# EAGLE design debug (EAGLE 5.09)
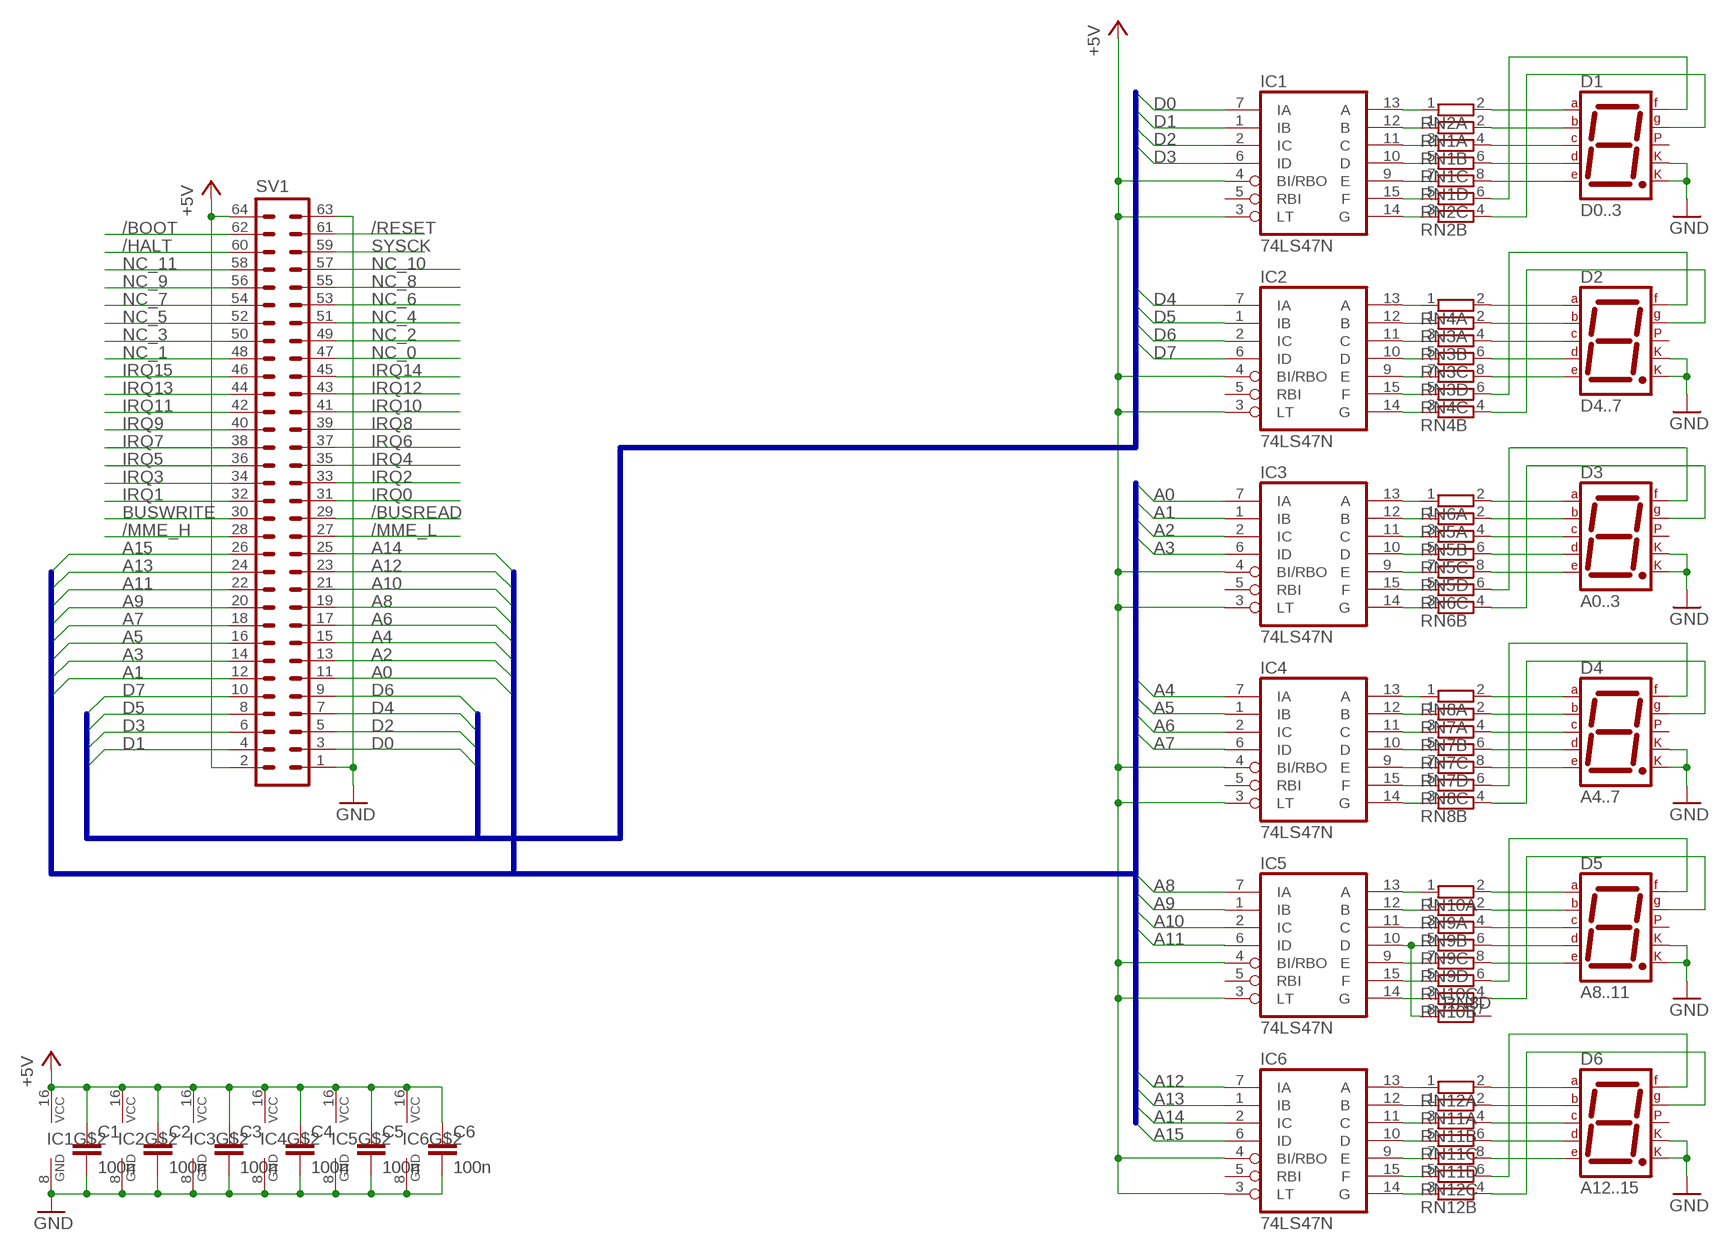
[diagram p0: schematic, sheet 1]

## Parts
C1  100n  C-EU025-024X044  [C025-024X044]
C2  100n  C-EU025-024X044  [C025-024X044]
C3  100n  C-EU025-024X044  [C025-024X044]
C4  100n  C-EU025-024X044  [C025-024X044]
C5  100n  C-EU025-024X044  [C025-024X044]
C6  100n  C-EU025-024X044  [C025-024X044]
D1  D0..3  7SEG-CK  [7SEG-13]
D2  D4..7  7SEG-CK  [7SEG-13]
D3  A0..3  7SEG-CK  [7SEG-13]
D4  A4..7  7SEG-CK  [7SEG-13]
D5  A8..11  7SEG-CK  [7SEG-13]
D6  A12..15  7SEG-CK  [7SEG-13]
IC1  74LS47N  [DIL16]
IC2  74LS47N  [DIL16]
IC3  74LS47N  [DIL16]
IC4  74LS47N  [DIL16]
IC5  74LS47N  [DIL16]
IC6  74LS47N  [DIL16]
RN1  E4R  [SIL8]
RN2  E4R  [SIL8]
RN3  E4R  [SIL8]
RN4  E4R  [SIL8]
RN5  E4R  [SIL8]
RN6  E4R  [SIL8]
RN7  E4R  [SIL8]
RN8  E4R  [SIL8]
RN9  E4R  [SIL8]
RN10  E4R  [SIL8]
RN11  E4R  [SIL8]
RN12  E4R  [SIL8]
SV1  ML64L  [ML64L]

## Nets
+5V: C1.1 C2.1 C3.1 C4.1 C5.1 C6.1 IC1.3(LT) IC1.4(BI/RBO) IC1.16(VCC) IC2.3(LT) IC2.4(BI/RBO) IC2.16(VCC) IC3.3(LT) IC3.4(BI/RBO) IC3.16(VCC) IC4.3(LT) IC4.4(BI/RBO) IC4.16(VCC) IC5.3(LT) IC5.4(BI/RBO) IC5.16(VCC) IC6.3(LT) IC6.4(BI/RBO) IC6.16(VCC) SV1.2 SV1.64
/BOOT: SV1.62
/BUSREAD: SV1.29
/HALT: SV1.60
/MME_H: SV1.28
/MME_L: SV1.27
/RESET: SV1.61
A0: IC3.7(IA) SV1.11
A1: IC3.1(IB) SV1.12
A2: IC3.2(IC) SV1.13
A3: IC3.6(ID) SV1.14
A4: IC4.7(IA) SV1.15
A5: IC4.1(IB) SV1.16
A6: IC4.2(IC) SV1.17
A7: IC4.6(ID) SV1.18
A8: IC5.7(IA) SV1.19
A9: IC5.1(IB) SV1.20
A10: IC5.2(IC) SV1.21
A11: IC5.6(ID) SV1.22
A12: IC6.7(IA) SV1.23
A13: IC6.1(IB) SV1.24
A14: IC6.2(IC) SV1.25
A15: IC6.6(ID) SV1.26
BUSWRITE: SV1.30
D0: IC1.7(IA) SV1.3
D1: IC1.1(IB) SV1.4
D2: IC1.2(IC) SV1.5
D3: IC1.6(ID) SV1.6
D4: IC2.7(IA) SV1.7
D5: IC2.1(IB) SV1.8
D6: IC2.2(IC) SV1.9
D7: IC2.6(ID) SV1.10
GND: C1.2 C2.2 C3.2 C4.2 C5.2 C6.2 D1.3(CK1) D1.8(CK2) D2.3(CK1) D2.8(CK2) D3.3(CK1) D3.8(CK2) D4.3(CK1) D4.8(CK2) D5.3(CK1) D5.8(CK2) D6.3(CK1) D6.8(CK2) IC1.8(GND) IC2.8(GND) IC3.8(GND) IC4.8(GND) IC5.8(GND) IC6.8(GND) SV1.1 SV1.63
IRQ0: SV1.31
IRQ1: SV1.32
IRQ2: SV1.33
IRQ3: SV1.34
IRQ4: SV1.35
IRQ5: SV1.36
IRQ6: SV1.37
IRQ7: SV1.38
IRQ8: SV1.39
IRQ9: SV1.40
IRQ10: SV1.41
IRQ11: SV1.42
IRQ12: SV1.43
IRQ13: SV1.44
IRQ14: SV1.45
IRQ15: SV1.46
N$1: IC1.13(A) RN2.1
N$2: IC1.12(B) RN1.1
N$3: IC1.11(C) RN1.3
N$4: IC1.10(D) RN1.5
N$5: IC1.9(E) RN1.7
N$6: IC1.15(F) RN2.5
N$7: IC1.14(G) RN2.3
N$8: D1.7(A) RN2.2
N$9: D1.6(B) RN1.2
N$10: D1.4(C) RN1.4
N$11: D1.2(D) RN1.6
N$12: D1.1(E) RN1.8
N$13: D1.9(F) RN2.6
N$14: D1.10(G) RN2.4
N$15: IC2.13(A) RN4.1
N$16: IC2.12(B) RN3.1
N$17: IC2.11(C) RN3.3
N$18: IC2.10(D) RN3.5
N$19: IC2.9(E) RN3.7
N$20: IC2.15(F) RN4.5
N$21: IC2.14(G) RN4.3
N$22: D2.7(A) RN4.2
N$23: D2.6(B) RN3.2
N$24: D2.4(C) RN3.4
N$25: D2.2(D) RN3.6
N$26: D2.1(E) RN3.8
N$27: D2.9(F) RN4.6
N$28: D2.10(G) RN4.4
N$29: IC3.13(A) RN6.1
N$30: IC3.12(B) RN5.1
N$31: IC3.11(C) RN5.3
N$32: IC3.10(D) RN5.5
N$33: IC3.9(E) RN5.7
N$34: IC3.15(F) RN6.5
N$35: IC3.14(G) RN6.3
N$36: D3.7(A) RN6.2
N$37: D3.6(B) RN5.2
N$38: D3.4(C) RN5.4
N$39: D3.2(D) RN5.6
N$40: D3.1(E) RN5.8
N$41: D3.9(F) RN6.6
N$42: D3.10(G) RN6.4
N$43: IC4.13(A) RN8.1
N$44: IC4.12(B) RN7.1
N$45: IC4.11(C) RN7.3
N$46: IC4.10(D) RN7.5
N$47: IC4.9(E) RN7.7
N$48: IC4.15(F) RN8.5
N$49: IC4.14(G) RN8.3
N$50: D4.7(A) RN8.2
N$51: D4.6(B) RN7.2
N$52: D4.4(C) RN7.4
N$53: D4.2(D) RN7.6
N$54: D4.1(E) RN7.8
N$55: D4.9(F) RN8.6
N$56: D4.10(G) RN8.4
N$57: IC5.13(A) RN10.1
N$58: IC5.12(B) RN9.1
N$59: IC5.11(C) RN9.3
N$60: IC5.10(D) RN8.8 RN9.5
N$61: IC5.9(E) RN9.7
N$62: IC5.15(F) RN10.5
N$63: IC5.14(G) RN10.3
N$64: D5.7(A) RN10.2
N$65: D5.6(B) RN9.2
N$66: D5.4(C) RN9.4
N$67: D5.2(D) RN9.6
N$68: D5.1(E) RN9.8
N$69: D5.9(F) RN10.6
N$70: D5.10(G) RN10.4
N$71: IC6.13(A) RN12.1
N$72: IC6.12(B) RN11.1
N$73: IC6.11(C) RN11.3
N$74: IC6.10(D) RN11.5
N$75: IC6.9(E) RN11.7
N$76: IC6.15(F) RN12.5
N$77: IC6.14(G) RN12.3
N$78: D6.7(A) RN12.2
N$79: D6.6(B) RN11.2
N$80: D6.4(C) RN11.4
N$81: D6.2(D) RN11.6
N$82: D6.1(E) RN11.8
N$83: D6.9(F) RN12.6
N$84: D6.10(G) RN12.4
NC_0: SV1.47
NC_1: SV1.48
NC_2: SV1.49
NC_3: SV1.50
NC_4: SV1.51
NC_5: SV1.52
NC_6: SV1.53
NC_7: SV1.54
NC_8: SV1.55
NC_9: SV1.56
NC_10: SV1.57
NC_11: SV1.58
SYSCK: SV1.59
Unconnected: D1.5(DP) D2.5(DP) D3.5(DP) D4.5(DP) D5.5(DP) D6.5(DP) IC1.5(RBI) IC2.5(RBI) IC3.5(RBI) IC4.5(RBI) IC5.5(RBI) IC6.5(RBI) RN2.7 RN2.8 RN4.7 RN4.8 RN6.7 RN6.8 RN8.7 RN10.7 RN10.8 RN12.7 RN12.8

## Buses
D[0..7]
A[0..15]

## Library data of the parts
C1-C6 = rcl:C-EU: CAPACITOR, European symbol
D1-D6 = special:7SEG-CK: 7-segment DISPLAY single cathode, 13 mm
IC1-IC6 = 74xx-eu:74*47: BCD to seven segment DECODER/DRIVER Source: http://www.ee.washington.edu/stores/DataSheets/74ls/74ls47.pdf
RN1-RN12 = resistor-sil:E4R: SIL RESISTOR
SV1 = mcpu:ML64L: HARTING

## Net classes
0 Signal: width 0.254 mm, drill 0.508 mm, clearance 0.203 mm
1 LoVolt42: width 0.61 mm, drill 0.508 mm, clearance 0.813 mm to class 0, clearance 0.305 mm
2 MedVolt100: width 0.61 mm, drill 0.508 mm, clearance 1.626 mm to class 0, clearance 1.626 mm to class 1, clearance 0.813 mm
3 LineVolt350: width 0.813 mm, drill 0.508 mm, clearance 12.7 mm to class 0, clearance 12.7 mm to class 1, clearance 12.7 mm to class 2, clearance 2.54 mm

## Board
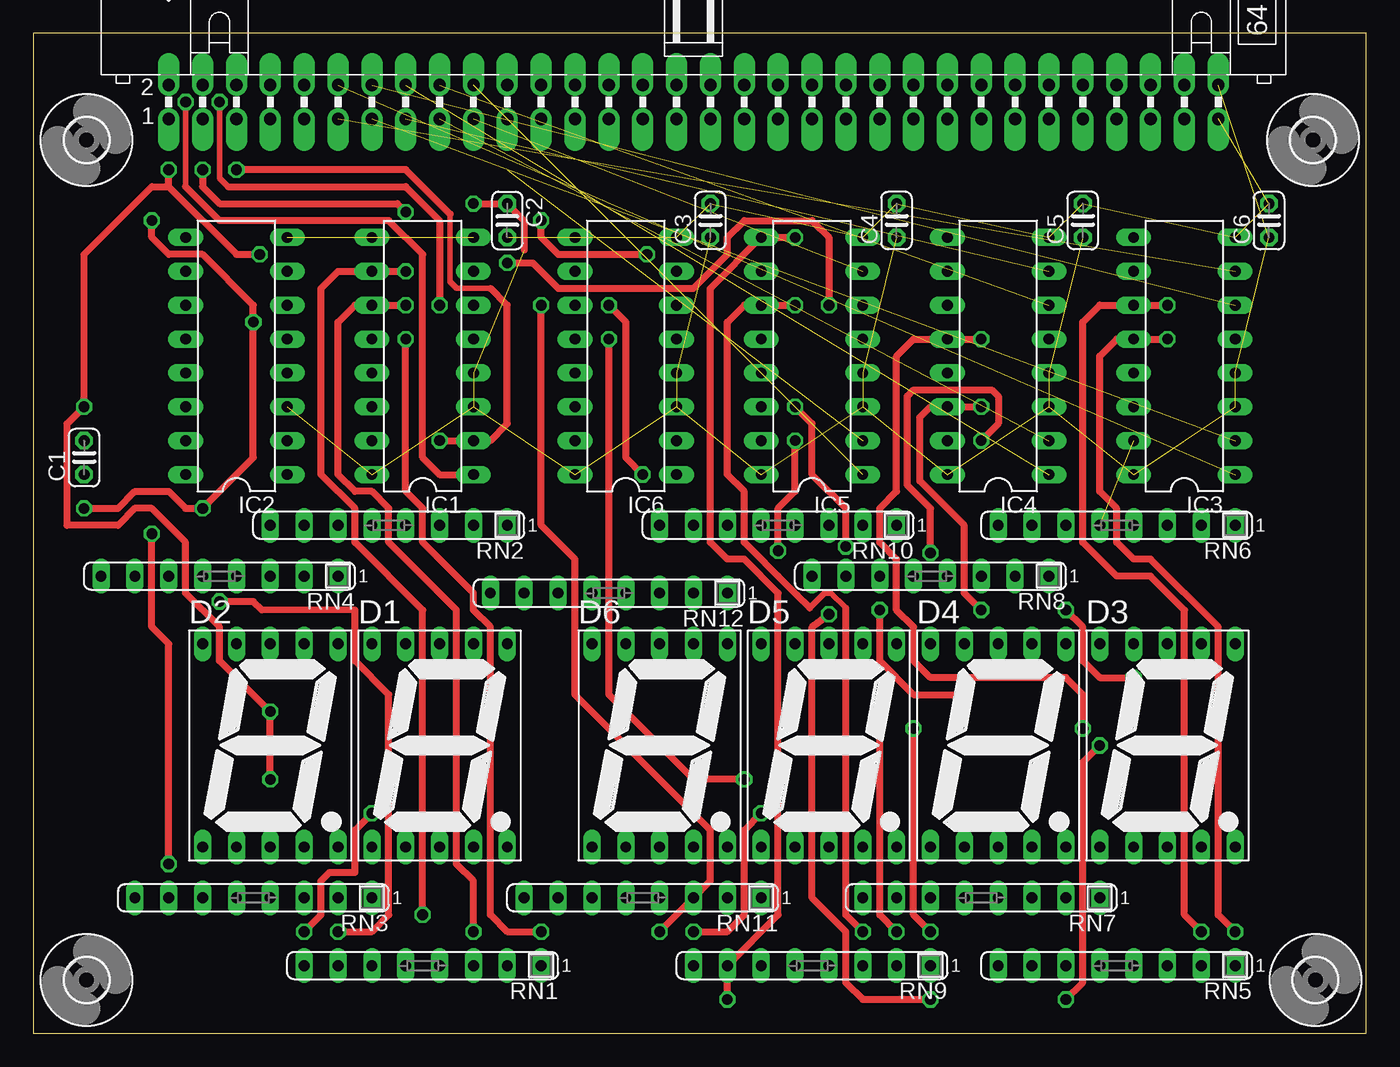
[diagram p1: board, top side]
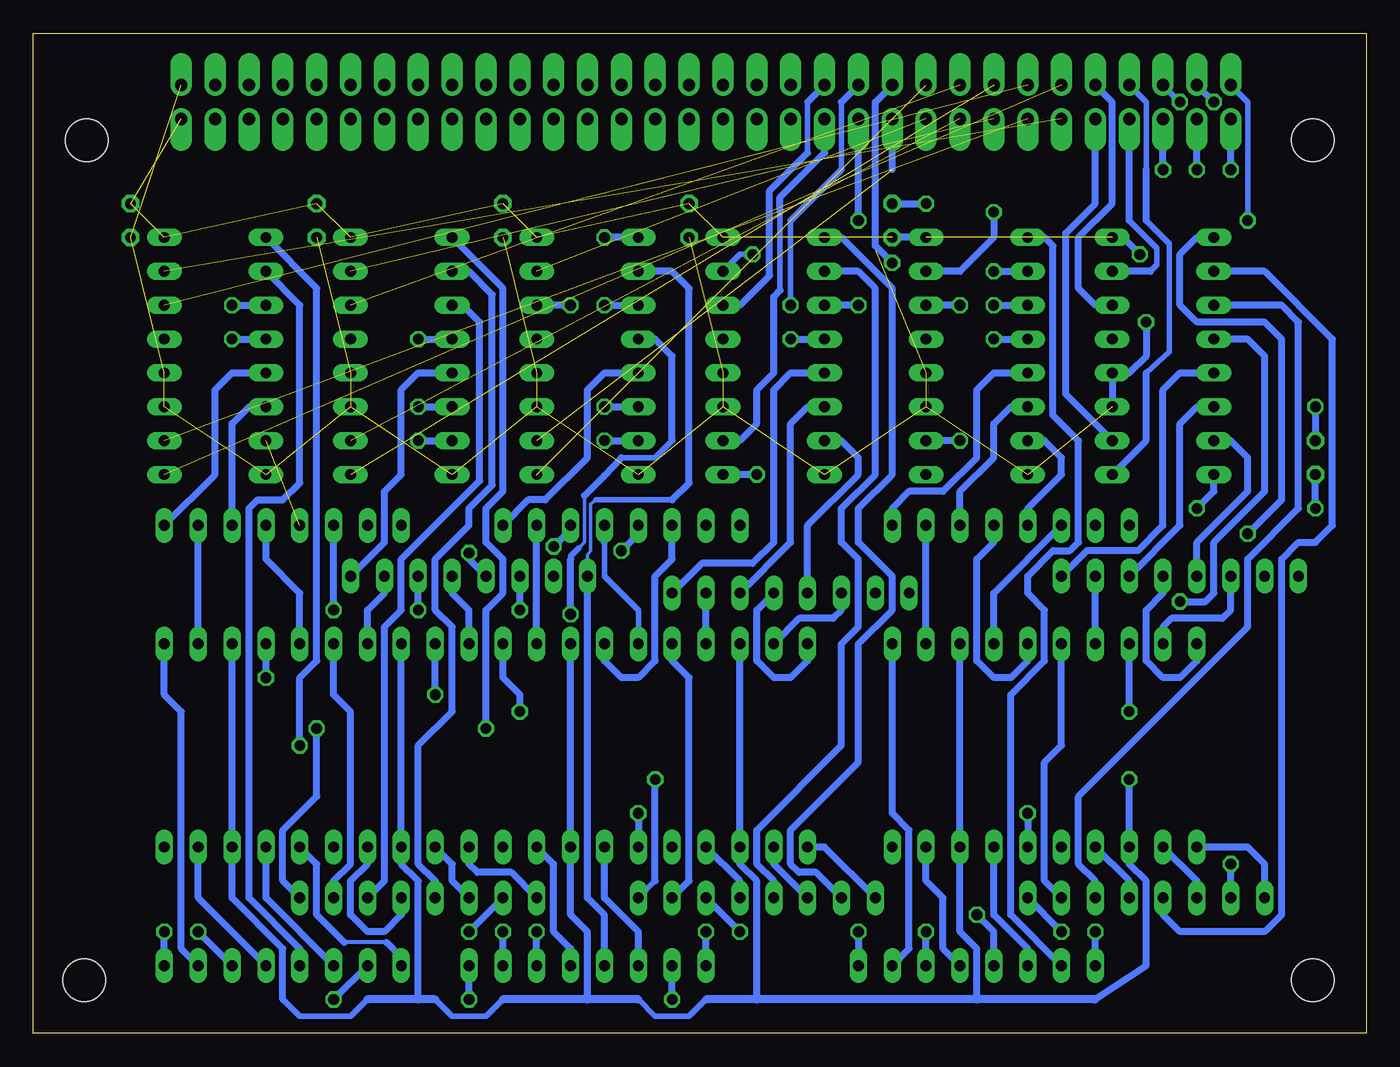
[diagram p2: board, bottom side, seen from below]

Size 100 x 75 mm. Coordinates in mm from the lower left corner, seen from the top.
Outline: 0,0 100,0 100,75 0,75 0,0
Copper layers (1*16): Top 0.035mm / dielectric 1.5mm / Bottom 0.035mm
Design rules "designrules": minimum track width 10mil, minimum drill 24mil, track to track 8mil, track to pad 8mil, pad to pad 8mil, via to via 8mil, smd to smd 8mil, copper to edge 40mil, drill to drill 8mil, minimum pad ring 10mil, minimum via ring 8mil, stop-mask expansion 4mil, vias tented up to drill 0mil, thermal gap 10mil

### Footprints (pad centres in the part's own frame; a part is rotated, then mirrored left to right if it is on the bottom)
C025-024X044 = drill 0.813 octagon: 1 -1.27,0; 2 1.27,0
7SEG-13 = drill 0.813 long: 1 -5.08,-7.62; 2 -2.54,-7.62; 3 0,-7.62; 4 2.54,-7.62; 5 5.08,-7.62; 6 5.08,7.62; 7 2.54,7.62; 8 0,7.62; 9 -2.54,7.62; 10 -5.08,7.62
DIL16 = drill 0.813 long: 1 -8.89,-3.81; 2 -6.35,-3.81; 3 -3.81,-3.81; 4 -1.27,-3.81; 5 1.27,-3.81; 6 3.81,-3.81; 7 6.35,-3.81; 8 8.89,-3.81; 9 8.89,3.81; 10 6.35,3.81; 11 3.81,3.81; 12 1.27,3.81; 13 -1.27,3.81; 14 -3.81,3.81; 15 -6.35,3.81; 16 -8.89,3.81
SIL8 = drill 0.813 long: 1 -8.89,0; 2 -6.35,0; 3 -3.81,0; 4 -1.27,0; 5 1.27,0; 6 3.81,0; 7 6.35,0; 8 8.89,0
ML64L = drill 0.914 pad 1.6 offset: 1 -39.37,-1.27; 2 -39.37,1.27; 3 -36.83,-1.27; 4 -36.83,1.27; 5 -34.29,-1.27; 6 -34.29,1.27; 7 -31.75,-1.27; 8 -31.75,1.27; 9 -29.21,-1.27; 10 -29.21,1.27; 11 -26.67,-1.27; 12 -26.67,1.27; 13 -24.13,-1.27; 14 -24.13,1.27; 15 -21.59,-1.27; 16 -21.59,1.27; 17 -19.05,-1.27; 18 -19.05,1.27; 19 -16.51,-1.27; 20 -16.51,1.27; 21 -13.97,-1.27; 22 -13.97,1.27; 23 -11.43,-1.27; 24 -11.43,1.27; 25 -8.89,-1.27; 26 -8.89,1.27; 27 -6.35,-1.27; 28 -6.35,1.27; 29 -3.81,-1.27; 30 -3.81,1.27; 31 -1.27,-1.27; 32 -1.27,1.27; 33 1.27,-1.27; 34 1.27,1.27; 35 3.81,-1.27; 36 3.81,1.27; 37 6.35,-1.27; 38 6.35,1.27; 39 8.89,-1.27; 40 8.89,1.27; 41 11.43,-1.27; 42 11.43,1.27; 43 13.97,-1.27; 44 13.97,1.27; 45 16.51,-1.27; 46 16.51,1.27; 47 19.05,-1.27; 48 19.05,1.27; 49 21.59,-1.27; 50 21.59,1.27; 51 24.13,-1.27; 52 24.13,1.27; 53 26.67,-1.27; 54 26.67,1.27; 55 29.21,-1.27; 56 29.21,1.27; 57 31.75,-1.27; 58 31.75,1.27; 59 34.29,-1.27; 60 34.29,1.27; 61 36.83,-1.27; 62 36.83,1.27; 63 39.37,-1.27; 64 39.37,1.27
3,2 = hole 3.2: 0,0

### Placement (x,y rotation side)
C1  3.81,43.18 90 top
C2  35.56,60.96 270 top
C3  50.8,60.96 90 top
C4  64.77,60.96 90 top
C5  78.74,60.96 90 top
C6  92.71,60.96 90 top
D1  30.48,21.59 0 top
D2  17.78,21.59 0 top
D3  85.09,21.59 0 top
D4  72.39,21.59 0 top
D5  59.69,21.59 0 top
D6  46.99,21.59 0 top
IC1  29.21,50.8 90 top
IC2  15.24,50.8 90 top
IC3  86.36,50.8 90 top
IC4  72.39,50.8 90 top
IC5  58.42,50.8 90 top
IC6  44.45,50.8 90 top
RN1  29.21,5.08 180 top
RN2  26.67,38.1 180 top
RN3  16.51,10.16 180 top
RN4  13.97,34.29 180 top
RN5  81.28,5.08 180 top
RN6  81.28,38.1 180 top
RN7  71.12,10.16 180 top
RN8  67.31,34.29 180 top
RN9  58.42,5.08 180 top
RN10  55.88,38.1 180 top
RN11  45.72,10.16 180 top
RN12  43.18,33.02 180 top
SV1  49.53,69.85 0 top
U$1  [3,2]  4,4 0 top
U$2  [3,2]  4,67 0 top
U$3  [3,2]  96,67 0 top
U$4  [3,2]  96.19,4 0 top

### Tracks (layer width: path | path; a pad name or v marks a point on that pad's centre or on a via)
+5V  (via drill 0.8)  (21 unrouted)
  Top 0.508: v3.81,39.37 6.35,39.37 7.62,40.64 10.16,40.64 11.43,39.37 v12.7,39.37 16.51,43.18 v16.51,53.34 16.51,54.61 12.7,58.42 10.16,58.42 8.89,59.69 v8.89,60.96 | v33.02,62.23 C2.1 36.83,60.96 36.83,58.74
  Bottom 0.406: v8.89,60.96 8.89,69.85 SV1.2
  Bottom 0.508: IC2.16 11.43,40.64 v12.7,39.37 | v3.81,39.37 C1.1 | IC2.3 IC2.4 17.78,49.53 16.51,50.8 v16.51,53.34 | C2.1 v33.02,62.23
A0  (1 unrouted)
A1  (1 unrouted)
A2  (1 unrouted)
A3  (1 unrouted)
A4  (1 unrouted)
A5  (1 unrouted)
A6  (1 unrouted)
A7  (1 unrouted)
A8  (1 unrouted)
A9  (1 unrouted)
A10  (1 unrouted)
  Bottom 0.508: 35.56,64.77 SV1.21
A11  (via drill 0.8)
  Top 0.508: v35.56,57.78 37.47,57.78 39.37,55.88 49.53,55.88 52.07,58.42 52.07,59.69 53.34,60.96 58.42,60.96 59.69,59.69 v59.69,54.61
  Bottom 0.508: SV1.22 36.83,69.85 36.83,59.05 v35.56,57.78 | v59.69,54.61 IC5.6
A12  (via drill 0.8)
  Top 0.508: v38.1,60.96 38.1,59.69 39.37,58.42 v46.04,58.42
  Bottom 0.406: v46.04,58.42 46.99,58.42 IC6.7
  Bottom 0.508: v38.1,60.96 SV1.23
A13  (via drill 0.8)
  Top 0.508: v43.18,54.61 44.45,53.34 44.45,43.18 v45.72,41.91
  Bottom 0.406: 39.37,64.77 39.37,69.85 | v43.18,54.61 43.18,60.96
  Bottom 0.508: 39.37,69.85 SV1.24 | 43.18,60.96 39.37,64.77 | v45.72,41.91 IC6.1
A14
  Bottom 0.406: 43.97,55.72 43.97,61.75
  Bottom 0.508: SV1.25 40.64,66.04 43.97,62.71 43.97,61.75 | 43.97,55.72 44.45,55.24 44.45,49.53 45.72,48.26 45.72,45.72 46.99,44.45 IC6.2
A15
  Bottom 0.406: 41.91,66.04 41.91,69.85
  Bottom 0.508: 41.91,69.85 SV1.26 | 41.91,66.04 44.77,63.18 44.77,56.83 46.99,54.61 IC6.6
D0  (via drill 0.8)
  Top 0.508: v12.7,64.77 12.7,63.5 13.97,62.23 27.3,62.23 v27.94,61.59
  Bottom 0.508: v12.7,64.77 SV1.3 | v27.94,61.59 27.94,59.69 30.48,57.15 IC1.7
D1  (via drill 0.8)
  Top 0.406: 11.43,63.5 v11.43,69.85
  Top 0.508: 11.43,63.5 13.97,60.96 26.67,60.96 29.21,58.42 29.21,43.18 30.48,41.91 IC1.1
  Bottom 0.508: v11.43,69.85 SV1.4
D2  (via drill 0.8)
  Top 0.406: 31.27,61.44 31.27,56.36 31.75,55.88 34.29,55.88
  Top 0.508: v15.24,64.77 27.94,64.77 31.27,61.44 | 34.29,55.88 35.56,54.61 35.56,45.72 34.29,44.45 v30.48,44.45
  Bottom 0.508: v15.24,64.77 SV1.5 | v30.48,44.45 IC1.2
D3  (via drill 0.8)
  Top 0.406: v13.97,69.85 13.97,64.14 14.61,63.5
  Top 0.508: 14.61,63.5 27.94,63.5 30.48,60.96 v30.48,54.61
  Bottom 0.406: v13.97,69.85 SV1.6
  Bottom 0.508: v30.48,54.61 IC1.6
D4
  Bottom 0.406: 17.78,60.96 15.72,58.9 15.72,57.63 16.19,57.15
  Bottom 0.508: 17.78,60.96 SV1.7 | 16.19,57.15 IC2.7
D5
  Bottom 0.406: 16.51,64.77 16.51,69.85 SV1.8 | 16.51,60.96 14.76,59.21 14.76,51.12 16.51,49.53
  Bottom 0.508: IC2.1 16.51,44.45 16.51,49.53 | 16.51,60.96 16.51,64.77
D6
  Bottom 0.508: SV1.9 20.32,62.23 22.54,60.01 22.54,47.94 IC2.2
D7
  Bottom 0.508: SV1.10 19.05,69.85 19.05,62.23 21.59,59.69 21.59,55.88 20.32,54.61 IC2.6
GND  (via drill 0.8)  (10 unrouted)
  Top 0.508: v17.78,19.05 v17.78,24.13 13.97,27.94 13.97,30.48 11.43,33.02 11.43,36.83 8.89,39.37 7.62,39.37 6.35,38.1 2.54,38.1 2.54,45.72 v3.81,46.99 3.81,58.42 8.89,63.5 10.16,63.5 | v16.99,58.42 15.24,58.42 10.16,63.5 | 10.16,63.5 v10.16,64.77
  Bottom 0.406: 74.93,2.54 76.2,1.27 80.01,1.27 81.28,2.54 | 64.77,2.54 66.04,1.27 68.58,1.27 69.85,2.54 | 49.53,2.54 50.8,1.27 53.34,1.27 54.61,2.54
  Bottom 0.508: 20.32,2.54 16.51,5.08 16.51,11.43 17.78,12.7 D2.3 v17.78,19.05 | 29.21,2.54 29.21,6.35 30.48,7.62 D1.3 D1.8 | 45.72,2.54 45.72,11.43 46.99,12.7 D6.3 D6.8 | 58.42,2.54 58.42,7.62 59.69,8.89 D5.3 D5.8 | 71.12,2.54 71.12,11.43 72.39,12.7 D4.3 D4.8 | v17.78,24.13 D2.8 | D3.8 D3.3 85.09,10.16 81.28,6.35 81.28,2.54 | IC2.8 18.26,59.69 v16.99,58.42 | v10.16,64.77 SV1.1 | v3.81,46.99 C1.2 | IC1.8 C2.2
  Bottom 0.61: 74.93,2.54 71.12,2.54 69.85,2.54 | 64.77,2.54 58.42,2.54 54.61,2.54 | 49.53,2.54 45.72,2.54 29.21,2.54 20.32,2.54
N$1
  Bottom 0.508: RN2.1 35.56,39.37 34.29,40.64 31.75,40.64 29.21,43.18 29.21,48.26 27.94,49.53 IC1.13
N$2  (via drill 0.8)
  Top 0.508: v38.1,7.62 35.56,7.62 34.29,8.89 34.29,30.48 33.02,31.75 33.02,33.02 29.21,36.83 29.21,39.37 27.94,40.64 v27.94,52.07
  Bottom 0.508: v38.1,7.62 RN1.1 | v27.94,52.07 IC1.12
N$3  (via drill 0.8)
  Top 0.508: v33.02,7.62 33.02,11.43 31.75,12.7 31.75,31.75 26.67,36.83 26.67,39.37 25.4,40.64 24.13,40.64 22.86,41.91 22.86,53.34 24.13,54.61 v27.94,54.61
  Bottom 0.508: RN1.3 v33.02,7.62 | v27.94,54.61 IC1.11
N$4  (via drill 0.8)
  Top 0.508: v29.21,8.89 29.21,31.75 24.13,36.83 24.13,39.37 21.59,41.91 21.59,55.88 22.86,57.15 v27.94,57.15
  Bottom 0.508: RN1.5 27.94,7.62 v29.21,8.89 | v27.94,57.15 IC1.10
N$5
  Bottom 0.508: RN1.7 26.67,8.89 26.67,25.4 24.13,27.94 24.13,31.75 25.4,33.02 25.4,34.29 23.5,36.2 22.23,36.2 21.59,36.83 21.59,44.45 23.5,46.35 23.5,59.05 24.13,59.69 IC1.9
N$6
  Bottom 0.508: RN2.5 25.4,39.37 22.86,41.91 22.86,43.18 24.13,44.45 IC1.15
N$7
  Bottom 0.508: RN2.3 30.48,40.64 27.94,43.18 27.94,45.72 26.67,46.99 IC1.14
N$8
  Bottom 0.508: D1.7 RN2.2
N$9
  Bottom 0.508: RN1.2 34.29,6.35 34.29,15.24 35.56,16.51 D1.6
N$10
  Bottom 0.508: RN1.4 31.75,6.35 31.75,10.16 33.02,11.43 D1.4
N$11
  Bottom 0.508: RN1.6 25.4,6.35 27.94,8.89 D1.2
N$12  (via drill 0.8)
  Top 0.508: v20.32,7.62 21.59,8.89 21.59,11.43 22.23,12.06 24.13,12.06 24.13,15.24 v25.4,16.51
  Bottom 0.508: RN1.8 v20.32,7.62 | v25.4,16.51 D1.1
N$13
  Bottom 0.508: RN2.6 27.94,33.02 D1.9
N$14
  Bottom 0.508: RN2.4 27.94,36.83 29.21,35.56 29.21,27.94 27.94,26.67 26.67,26.67 25.4,27.94 D1.10
N$15
  Bottom 0.508: RN4.1 20.95,36.2 17.14,36.2 15.24,38.1 15.24,48.26 13.97,49.53 IC2.13
N$16  (via drill 0.8)
  Top 0.508: v22.86,7.62 25.4,7.62 26.67,8.89 26.67,25.4 24.13,27.94 24.13,31.75 17.14,31.75 16.51,32.38 v13.97,32.38
  Bottom 0.508: v22.86,7.62 RN3.1 | IC2.12 8.89,52.07 7.62,50.8 7.62,40.64 11.43,36.83 11.43,33.02 12.06,32.38 v13.97,32.38
N$17
  Bottom 0.508: RN3.3 20.32,11.43 21.59,12.7 21.59,17.78 8.89,30.48 8.89,35.56 5.08,39.37 5.08,53.34 6.35,54.61 IC2.11
N$18
  Bottom 0.508: RN3.5 15.24,8.89 13.97,7.62 7.62,7.62 6.35,8.89 6.35,35.56 5.08,36.83 3.81,36.83 2.54,38.1 2.54,52.07 7.62,57.15 IC2.10
N$19  (via drill 0.8)
  Top 0.508: v10.16,12.7 10.16,29.21 8.89,30.48 v8.89,37.47
  Bottom 0.508: RN3.7 v10.16,12.7 | v8.89,37.47 6.35,40.01 6.35,52.07 7.62,53.34 12.7,53.34 13.97,54.61 13.97,58.42 12.7,59.69 IC2.9
N$20
  Bottom 0.508: RN4.5 12.7,36.83 8.89,40.64 8.89,43.18 10.16,44.45 IC2.15
N$21
  Bottom 0.508: IC2.14 12.7,46.99 13.97,45.72 13.97,38.1 RN4.3
N$22
  Bottom 0.508: D2.7 RN4.2
N$23
  Bottom 0.508: RN3.2 24.13,11.43 24.13,20.32 22.86,21.59 D2.6
N$24
  Bottom 0.508: RN3.4 17.78,11.43 D2.4
N$25
  Bottom 0.508: D2.2 12.7,11.43 RN3.6
N$26
  Bottom 0.508: RN3.8 7.62,12.7 8.89,13.97 D2.1
N$27
  Bottom 0.508: D2.9 15.24,30.48 14.61,31.11 10.79,31.11 10.16,31.75 RN4.6
N$28
  Bottom 0.508: RN4.4 15.24,33.02 16.51,31.75 16.51,27.94 15.24,26.67 13.97,26.67 12.7,27.94 D2.10
N$29
  Bottom 0.508: RN6.1 86.36,41.91 86.36,48.26 85.09,49.53 IC3.13
N$30  (via drill 0.8)
  Top 0.508: v85.09,52.07 81.28,52.07 80.01,50.8 80.01,40.64 81.28,39.37 81.28,36.83 82.55,35.56 83.82,35.56 88.9,30.48 88.9,8.89 v90.17,7.62
  Bottom 0.508: v85.09,52.07 IC3.12 | RN5.1 v90.17,7.62
N$31  (via drill 0.8)
  Top 0.508: v87.63,7.62 86.36,8.89 86.36,31.75 83.82,34.29 81.28,34.29 78.74,36.83 78.74,53.34 80.01,54.61 v85.09,54.61
  Bottom 0.508: RN5.3 v87.63,7.62 | v85.09,54.61 IC3.11
N$32
  Bottom 0.508: RN5.5 80.01,6.35 83.82,10.16 83.82,39.37 83.19,40.01 81.28,40.01 80.01,41.27 80.01,54.61 IC3.10
N$33  (via drill 0.8)
  Top 0.508: v77.47,2.54 78.74,3.81 78.74,20.32 v80.01,21.59
  Bottom 0.508: RN5.7 v77.47,2.54 | IC3.9 78.74,55.88 78.74,27.94 80.01,26.67 v80.01,21.59
N$34  (1 unrouted)
N$35
  Bottom 0.508: RN6.3 85.09,45.72 83.82,46.99 IC3.14
N$36
  Bottom 0.508: D3.7 RN6.2
N$37
  Bottom 0.508: RN5.2 88.9,6.35 88.9,24.13 90.17,25.4 D3.6
N$38
  Bottom 0.508: RN5.4 87.63,10.16 D3.4
N$39
  Bottom 0.508: RN5.6 82.55,10.16 D3.2
N$40
  Bottom 0.305: 73.5,6.83 76.68,6.83
  Bottom 0.508: RN5.8 72.39,5.71 73.5,6.83 | 76.68,6.83 78.74,8.89 78.74,12.7 D3.1
N$41  (via drill 0.8)
  Top 0.508: v82.55,26.67 80.01,26.67 78.74,27.94 78.74,30.48 v77.47,31.75
  Bottom 0.508: v82.55,26.67 D3.9 | v77.47,31.75 RN6.6
N$42
  Bottom 0.508: D3.10 80.01,33.02 82.55,35.56 RN6.4
N$43
  Bottom 0.508: RN8.1 73.66,36.83 73.66,40.64 72.39,41.91 72.39,48.26 71.12,49.53 IC4.13
N$44  (via drill 0.8)
  Top 0.508: v78.74,22.86 78.74,25.4 77.47,26.67 67.31,26.67 66.04,27.94 66.04,30.48 64.77,31.75 64.77,35.56 63.5,36.83 63.5,39.37 64.77,40.64 64.77,50.8 66.04,52.07 v71.12,52.07
  Bottom 0.508: RN7.1 81.28,11.43 81.28,15.24 78.74,17.78 v78.74,22.86 | v71.12,52.07 IC4.12
N$45
  Bottom 0.508: RN7.3 73.66,11.43 73.66,30.48 72.39,31.75 72.39,35.56 66.52,41.43 66.52,53.34 67.79,54.61 IC4.11
N$46
  Bottom 0.508: RN7.5 69.85,11.43 71.12,12.7 71.12,21.59 68.58,24.13 68.58,30.48 69.85,31.75 69.85,35.56 67.31,38.1 67.31,39.37 65.56,41.12 65.56,55.4 67.31,57.15 IC4.10
N$47  (via drill 0.8)
  Top 0.508: v67.31,7.62 66.04,8.89 v66.04,22.86
  Bottom 0.508: RN7.7 v67.31,7.62 | v66.04,22.86 66.04,31.75 64.77,33.02 64.77,35.56 66.04,36.83 66.04,39.37 64.77,40.64 64.77,55.88 IC4.9
N$48  (via drill 0.8)
  Top 0.508: v67.31,36.04 67.31,39.37 65.56,41.12 65.56,47.78 66.04,48.26 71.91,48.26 72.39,47.78 72.39,45.72 v71.12,44.45
  Bottom 0.508: RN8.5 67.31,35.56 v67.31,36.04 | v71.12,44.45 IC4.15
N$49  (via drill 0.8)
  Top 0.508: v71.12,31.75 69.85,33.02 69.85,38.1 66.52,41.43 66.52,46.2 67.31,46.99 v71.12,46.99
  Bottom 0.508: v71.12,31.75 RN8.3 | v71.12,46.99 IC4.14
N$50
  Bottom 0.508: D4.7 74.93,31.75 73.66,33.02 RN8.2
N$51
  Bottom 0.508: RN7.2 77.47,11.43 76.2,12.7 76.2,24.13 77.47,25.4 D4.6
N$52
  Bottom 0.508: RN7.4 72.39,8.89 73.66,7.62 74.93,7.62 76.2,8.89 76.2,11.43 74.93,12.7 D4.4
N$53
  Bottom 0.508: RN7.6 68.58,11.43 68.58,12.7 D4.2
N$54
  Bottom 0.508: RN7.8 64.14,12.06 66.67,12.06 67.31,12.7 D4.1
N$55  (via drill 0.8)
  Top 0.508: v63.5,31.75 63.5,27.94 66.04,25.4 v69.85,25.4
  Bottom 0.508: v63.5,31.75 RN8.6 | v69.85,25.4 D4.9
N$56
  Bottom 0.508: D4.10 67.31,31.75 68.58,33.02 RN8.4
N$57
  Bottom 0.508: RN10.1 62.87,40.01 61.59,40.01 58.42,43.18 58.42,48.26 57.15,49.53 IC5.13
N$58  (via drill 0.8)
  Top 0.508: v67.31,2.54 62.23,2.54 60.96,3.81 60.96,7.62 58.42,10.16 58.42,30.48 v59.69,31.43
  Bottom 0.254: 58.66,40.32 58.66,36.83 59.05,36.43
  Bottom 0.406: 55.88,43.18 53.34,43.18 52.07,44.45 | 59.69,35.56 59.69,35.8 59.05,36.43
  Bottom 0.508: v67.31,2.54 RN9.1 | v59.69,31.43 59.69,35.56 | 52.07,44.45 52.07,50.8 53.34,52.07 IC5.12 | 55.88,43.18 57.15,41.83 58.66,40.32
N$59  (via drill 0.8)
  Top 0.406: 60.96,31.91 59.85,33.02 59.37,33.02 58.26,31.91
  Top 0.508: v62.23,7.62 60.96,8.89 60.96,31.91 | 58.26,31.91 57.31,32.86 55.88,34.29 53.98,36.2 53.34,36.83 53.34,40.64 52.07,41.91 52.07,53.34 53.34,54.61 v57.15,54.61
  Bottom 0.508: RN9.3 v62.23,7.62 | v57.15,54.61 IC5.11
N$60
  Bottom 0.254: 57.78,40.01 58.18,39.69 58.18,36.2 58.42,35.88 RN8.8
  Bottom 0.406: 57.78,40.01 52.07,40.01
  Bottom 0.508: RN9.5 57.15,8.89 58.42,10.16 RN8.8 | IC5.10 52.07,57.15 50.8,55.88 50.8,41.27 52.07,40.01
N$61  (via drill 0.8)
  Top 0.508: v52.07,2.54 RN9.7 55.88,8.89 55.88,33.02 53.34,35.56 52.07,35.56 50.8,36.83 50.8,55.88 IC5.9 v57.15,59.69
  Bottom 0.508: v52.07,2.54 RN9.7 | IC5.9 v57.15,59.69
N$62  (via drill 0.8)
  Top 0.508: v55.88,36.2 55.88,39.37 57.15,40.64 v57.15,44.45
  Bottom 0.508: RN10.5 54.61,37.47 v55.88,36.2 | v57.15,44.45 IC5.15
N$63  (via drill 0.8)
  Top 0.508: v57.15,46.99 58.42,45.72 58.42,41.91 60.96,39.37 v60.96,36.51
  Bottom 0.508: v57.15,46.99 IC5.14 | v60.96,36.51 59.69,37.78 RN10.3
N$64
  Bottom 0.508: D5.7 RN10.2
N$65  (via drill 0.8)
  Top 0.508: v64.77,7.62 63.5,8.89 v63.5,24.13
  Bottom 0.508: RN9.2 v64.77,7.62 | D5.6 64.77,26.67 63.5,25.4 v63.5,24.13
N$66
  Bottom 0.508: RN9.4 59.69,6.35 60.96,7.62 60.96,12.7 D5.4
N$67
  Bottom 0.508: RN9.6 54.61,7.62 57.15,10.16 D5.2
N$68  (via drill 0.8)
  Top 0.508: v49.53,7.62 52.07,7.62 53.34,8.89 53.34,15.24 v54.61,16.51
  Bottom 0.508: RN9.8 v49.53,7.62 | v54.61,16.51 D5.1
N$69
  Bottom 0.508: D5.9 57.15,27.94 55.88,26.67 54.61,26.67 53.34,27.94 53.34,34.29 52.07,35.56 RN10.6
N$70
  Bottom 0.406: D5.10 54.61,31.75 57.15,34.29 57.15,36.83
  Bottom 0.508: 57.15,36.83 RN10.4
N$71
  Bottom 0.508: RN12.1 49.85,35.24 46.04,35.24 44.45,36.83 44.45,48.26 43.18,49.53 IC6.13
N$72  (via drill 0.8)
  Top 0.508: v53.34,19.05 49.53,19.05 43.18,25.4 v43.18,52.07
  Bottom 0.406: RN11.1 53.34,11.43
  Bottom 0.508: 53.34,11.43 v53.34,19.05 | v43.18,52.07 IC6.12
N$73  (via drill 0.8)
  Top 0.508: v46.99,7.62 50.8,11.43 50.8,15.24 40.64,25.4 40.64,35.56 38.1,38.1 v38.1,54.61
  Bottom 0.508: v46.99,7.62 RN11.3 | v38.1,54.61 IC6.11
N$74
  Bottom 0.508: RN11.5 44.45,11.43 45.72,12.7 45.72,15.24 39.37,21.59 39.37,29.21 38.1,30.48 38.1,35.56 39.37,36.83 39.37,39.37 36.83,41.91 36.83,55.88 38.1,57.15 IC6.10
N$75
  Bottom 0.508: RN11.7 41.27,12.06 42.55,12.06 43.18,12.7 43.18,15.24 38.1,20.32 38.1,29.21 35.56,31.75 35.56,34.29 38.1,36.83 38.1,39.37 35.56,41.91 35.56,55.88 39.37,59.69 IC6.9
N$76
  Bottom 0.508: RN12.5 41.91,38.1 38.1,41.91 38.1,43.18 39.37,44.45 IC6.15
N$77
  Bottom 0.508: RN12.3 43.18,36.83 43.18,45.72 41.91,46.99 IC6.14
N$78
  Bottom 0.508: D6.7 RN12.2
N$79
  Bottom 0.508: RN11.2 50.8,11.43 50.8,26.67 52.07,27.94 D6.6
N$80
  Bottom 0.508: RN11.4 46.99,11.43 D6.4
N$81
  Bottom 0.508: RN11.6 44.45,12.7 D6.2
N$82
  Bottom 0.508: RN11.8 40.64,13.97 D6.1
N$83
  Bottom 0.508: D6.9 42.55,31.11 40.01,31.11 39.37,31.75 RN12.6
N$84
  Bottom 0.508: RN12.4 45.72,31.75 45.72,27.94 44.45,26.67 43.18,26.67 41.91,27.94 D6.10